# Altium schematic sheet Sheet1.SchDoc: FTDI-Based JTAG Board
size A4
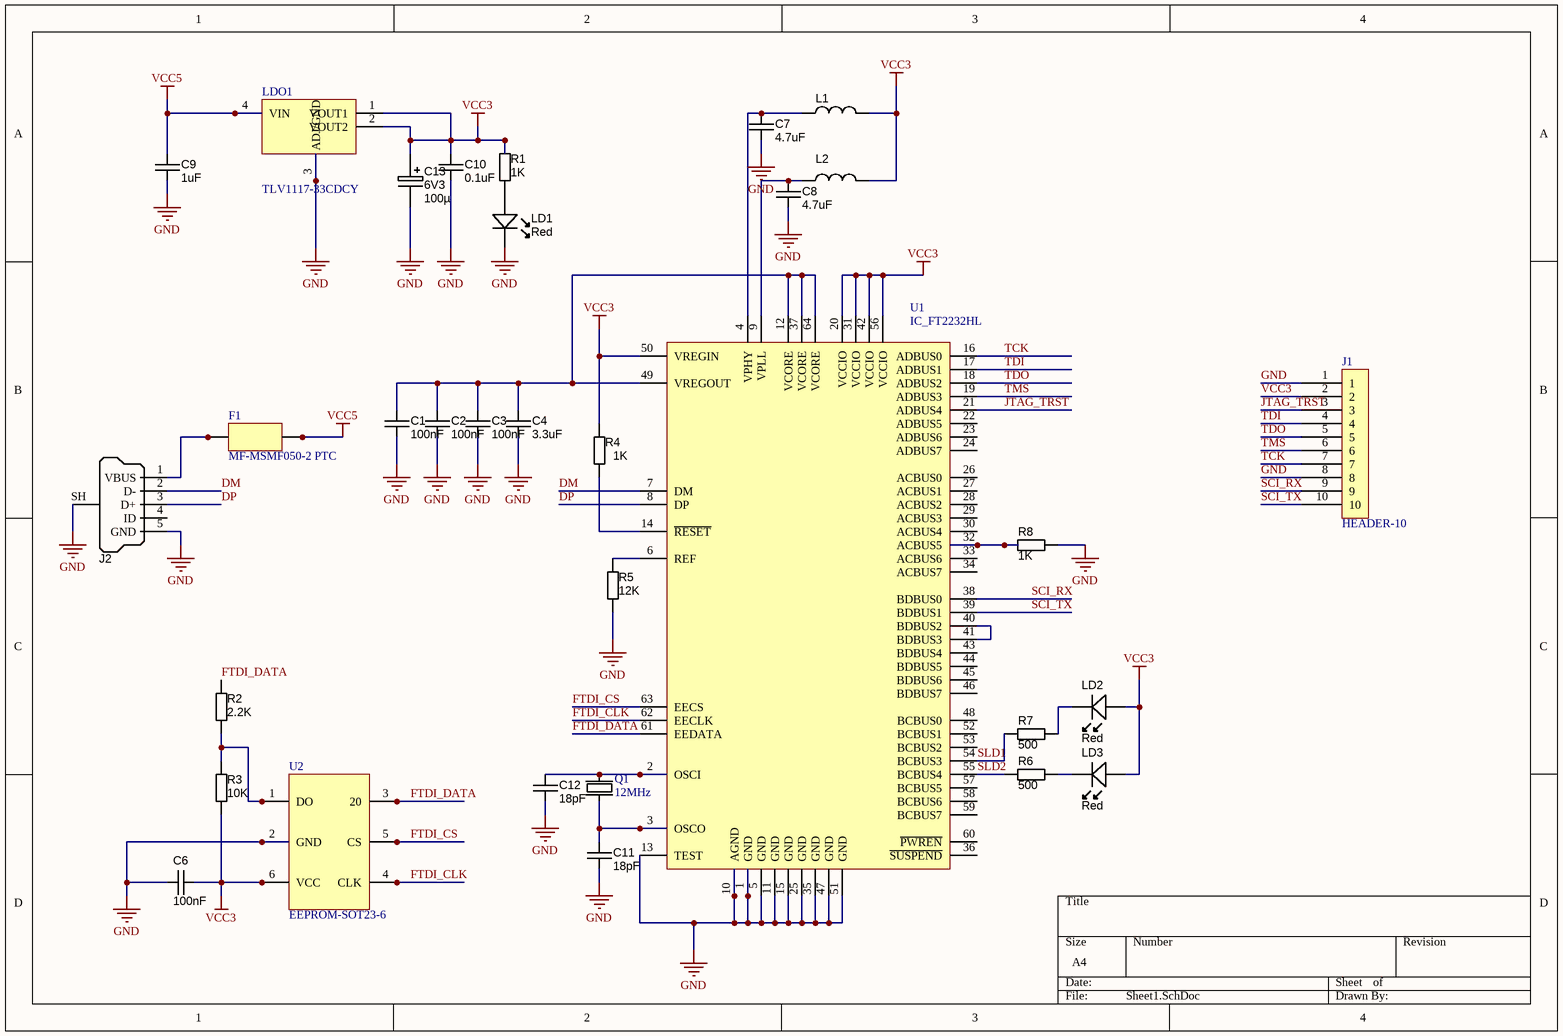
[diagram p0: Sheet1.SchDoc]

## Parts
C1  100nF  [CAPC1608X90N]
C2  100nF  [CAPC1608X90N]
C3  100nF  [CAPC1608X90N]
C4  3.3uF  [CAPC1608X90N]
C6  100nF  [CAPC1608X90N]
C7  4.7uF  [CAPC1608X90N]
C8  4.7uF  [CAPC1608X90N]
C9  1uF  [CAPC1608X90N]
C10  0.1uF  [CAPC1608X90N]
C11  18pF  [CAPC1608X90N]
C12  18pF  [CAPC1608X90N]
C13  Ratings: 6V3  [CAPMP3528X210N]  (hidden comment: 100µ)
F1  MF-MSMF050-2 PTC  [PTC-1218]
J1  HEADER-10  [MICRO-MATCH-10]
J2  USB Micro Type B (recommended if hand soldering)  [USB_Micro-B_FCI_SMD]  (value not drawn)
L1  120R @ 100 MHz  [INDC1608N]  (value not drawn)
L2  120R @ 100 MHz  [INDC1608N]  (value not drawn)
LD1  Red  [LED-0603-RED]
LD2  Red  [LED-0603-RED]
LD3  Red  [LED-0603-RED]
LDO1  TLV1117-33CDCY  [SOT223]
Q1  12MHz  [XTAL-5x3.2]
R1  value 1K  [RESC1608X55N]  (hidden comment: Thick Film)
R2  value 2.2K  [RESC1608X55N]  (hidden comment: Thick Film)
R3  value 10K  [RESC1608X55N]  (hidden comment: Thick Film)
R4  1K  [RESC1608X55N]
R5  value 12K  [RESC1608X55N]  (hidden comment: Thick Film)
R6  value 500  [RESC1608X55N]  (hidden comment: Thick Film)
R7  value 500  [RESC1608X55N]  (hidden comment: Thick Film)
R8  value 1K  [RESC1608X55N]  (hidden comment: Thick Film)
U1  IC_FT2232HL  [LQFP-64]
U2  EEPROM-SOT23-6  [SOT23-6-EEPROM]

## Nets
GND: C1.2 C2.2 C3.2 C4.2 C6.1 C7.2 C8.2 C9.2 C10.2 C11.2 C12.1 C13.2 J1.1 J1.8 J2.5(GND) J2.SH(Shell) LD1.K LDO1.3(ADJ/GND) R5.1 R8.1 U1.1(GND) U1.5(GND) U1.10(AGND) U1.11(GND) U1.13(TEST) U1.15(GND) U1.25(GND) U1.35(GND) U1.47(GND) U1.51(GND) U2.2(GND)
VCC3: C6.2 C10.1 C13.1 J1.2 L1.2 L2.2 LD2.A LD3.A LDO1.1(VOUT1) LDO1.2(VOUT2) R1.1 R3.2 R4.2 U1.20(VCCIO) U1.31(VCCIO) U1.42(VCCIO) U1.50(VREGIN) U1.56(VCCIO) U2.6(VCC)
VCC5: C9.1 F1.22 LDO1.4(VIN)
DM: J2.2(D-) U1.7(DM)
DP: J2.3(D+) U1.8(DP)
FTDI_CLK: U1.62(EECLK) U2.4(CLK)
FTDI_CS: U1.63(EECS) U2.5(CS)
FTDI_DATA: R2.1 U1.61(EEDATA) U2.3(20)
JTAG_TRST: J1.3 U1.21(ADBUS4)
SCI_RX: J1.9 U1.38(BDBUS0)
SCI_TX: J1.10 U1.39(BDBUS1)
SLD1: R7.2 U1.54(BCBUS3)
SLD2: R6.2 U1.55(BCBUS4)
TCK: J1.7 U1.16(ADBUS0)
TDI: J1.4 U1.17(ADBUS1)
TDO: J1.5 U1.18(ADBUS2)
TMS: J1.6 U1.19(ADBUS3)
NetC1_1: C1.1 C2.1 C3.1 C4.1 U1.12(VCORE) U1.37(VCORE) U1.49(VREGOUT) U1.64(VCORE)
NetC7_1: C7.1 L1.1 U1.4(VPHY)
NetC8_1: C8.1 L2.1 U1.9(VPLL)
NetC11_1: C11.1 Q1.1 U1.3(OSCO)
NetC12_2: C12.2 Q1.2 U1.2(OSCI)
NetF1_21: F1.21 J2.1(VBUS)
NetLD1_A: LD1.A R1.2
NetLD2_K: LD2.K R7.1
NetLD3_K: LD3.K R6.1
NetR2_2: R2.2 R3.1 U2.1(DO)
NetR4_1: R4.1 U1.14(~{RESET})
NetR5_2: R5.2 U1.6(REF)
NetR8_2: R8.2 U1.32(ACBUS5)
NetU1_40: U1.40(BDBUS2) U1.41(BDBUS3)

Not connected (* = marked no-connect by the designer): J2 4(ID); U1 22(ADBUS5) 23(ADBUS6) 24(ADBUS7) 26(ACBUS0) 27(ACBUS1) 28(ACBUS2) 29(ACBUS3) 30(ACBUS4) 33(ACBUS6) 34(ACBUS7) 36(~{SUSPEND}) 43(BDBUS4) 44(BDBUS5) 45(BDBUS6) 46(BDBUS7) 48(BCBUS0) 52(BCBUS1) 53(BCBUS2) 57(BCBUS5) 58(BCBUS6) 59(BCBUS7) 60(~{PWREN})

## Library data of the parts
C1-C4 C6-C12 = CAPC_39p_0603_NP0_100V_1%: Capacitor SMD Cer 39pF 1% 100V NP0 0603; Manufacturer 1: AVX Corporation; Manufacturer Part Number 1: 06031A390FAT2A; Ratings: 100V; NP0; SCDType: source; Temperature Coefficient: C0G, NP0; Tolerance: ±1%; Operating Temperature: -55°C ~ 125°C; Package / Case: 0603 (1608 Metric); Supplier 1: Digi-Key; Supplier Part Number 1: 478-5773-6-ND; RoHS 1: RoHS Compliant; ComponentLink1URL: http://www.avx.com/docs/Catalogs/ccog.pdf; ComponentLink1Description: http://www.avx.com/docs/Catalogs/ccog.pdf; Supplier 2: Digi-Key; Supplier Part Number 2: C0603C390F1GACTU-ND; Manufacturer 2: Kemet; Manufacturer Part Number 2: C0603C390F1GACTU; RoHS 2: RoHS Compliant; ComponentLink2URL: http://www.kemet.com/datasheets&C0603C390F1GACTU; ComponentLink2Description: http://www.kemet.com/datasheets&C0603C390F1GACTU; Supplier 3: Mouser; Supplier Part Number 3: 81-GRM1885C2A390FA1J; Manufacturer 3: Murata; Manufacturer Part Number 3: GRM1885C2A390FA01J; RoHS 3: RoHS Compliant; ComponentLink3URL: http://psearch.murata.com/capacitor/product/GRM0225C1C1R0WD05%23.pdf; ComponentLink3Description: http://psearch.murata.com/capacitor/product/GRM0225C1C1R0WD05%23.pdf
  C1-C3 C6: Value: 100nF
  C4: Value: 3.3uF
  C7 C8: Value: 4.7uF
  C9: Value: 1uF
  C10: Value: 0.1uF
  C11 C12: Value: 18pF
C13 = CAPT_100u_1210_6V3: Capacitor SMD Tantalum 100uF 20% 6.3V 1210; Manufacturer 1: AVX Corporation; Manufacturer Part Number 1: TCJB107M006R0045; SCDType: spec; Package / Case: 1210 (3528 Metric); Tolerance: ±20%; Material: Tantalum; Supplier 1: Digi-Key; Supplier Part Number 1: 478-4711-1-ND; Value: 100µ
F1 = MF-MSMF050-2 PTC: pin to pad: 21>1 22>2
J2 = USB_Micro_TypeB_FCI: Connector SMD-THD USB Micro Type B middle mount; Manufacturer 1: FCI; Manufacturer Part Number 1: 10103593-0001LF; SCDType: undef; Package / Case: SMD/THD mid-mount; Supplier 1: Digi-Key; Supplier Part Number 1: 609-4049-1-ND
L1 = FERRITE_120R-100MHz_0603: Ferrite bead 120 Ohm at 100 MHz 2A 0603 SMD; Manufacturer 1: Murata Electronics North America; Manufacturer Part Number 1: 600Ohm@100MHZ; Current: 900mA; DC Resistance (DCR): 172.9 mOhm Max; Frequency - Self Resonant: 23MHz; Frequency - Test: 100kHz; Impedance @ Frequency: 120 Ohm @ 100MHz; Filter Type: Differential Mode - Single; Number of Lines: 1; Ratings: 2 A; 50 mO DC; SCDType: source; Current - Saturation: 900mA; Current - Temperature Rise: 900mA; Applications: Power Supplies; Package / Case: 1210 (3225 Metric); Operating Temperature: -40°C ~ 105°C; ComponentLink1URL: http://www.yuden.co.jp/ut/product/pdf/wound02_e.pdf; ComponentLink1Description: http://www.yuden.co.jp/ut/product/pdf/wound02_e.pdf; Supplier 1: Digi-Key; Supplier Part Number 1: 490-1037-1-ND; Current Rating: 2A; Mounting Type: Surface Mount; Height (Max): 0.037" (0.95mm); Size / Dimension: 0.063" L x 0.031" W (1.60mm x 0.80mm); ComponentLink2URL: http://search.murata.co.jp/Ceramy/image/img/PDF/ENG/L0110S0100BLM18P.pdf; ComponentLink2Description: http://search.murata.co.jp/Ceramy/image/img/PDF/ENG/L0110S0100BLM18P.pdf; Value: 120R @ 100 MHz
L2 = FERRITE_120R-100MHz_0603: Ferrite bead 120 Ohm at 100 MHz 2A 0603 SMD; Manufacturer 1: Murata Electronics North America; Manufacturer Part Number 1: BLM18PG121SN1D; Current: 900mA; DC Resistance (DCR): 172.9 mOhm Max; Frequency - Self Resonant: 23MHz; Frequency - Test: 100kHz; Impedance @ Frequency: 120 Ohm @ 100MHz; Filter Type: Differential Mode - Single; Number of Lines: 1; Ratings: 2 A; 50 mO DC; SCDType: source; Current - Saturation: 900mA; Current - Temperature Rise: 900mA; Applications: Power Supplies; Package / Case: 1210 (3225 Metric); Operating Temperature: -40°C ~ 105°C; ComponentLink1URL: http://www.yuden.co.jp/ut/product/pdf/wound02_e.pdf; ComponentLink1Description: http://www.yuden.co.jp/ut/product/pdf/wound02_e.pdf; Supplier 1: Digi-Key; Supplier Part Number 1: 490-1037-1-ND; Current Rating: 2A; Mounting Type: Surface Mount; Height (Max): 0.037" (0.95mm); Size / Dimension: 0.063" L x 0.031" W (1.60mm x 0.80mm); ComponentLink2URL: http://search.murata.co.jp/Ceramy/image/img/PDF/ENG/L0110S0100BLM18P.pdf; ComponentLink2Description: http://search.murata.co.jp/Ceramy/image/img/PDF/ENG/L0110S0100BLM18P.pdf; Value: 120R @ 100 MHz
LD1-LD3 = LED_SMD_Red_0603_220mcd: LED 0603 SMD Hyper Red 630nm 220mcd 20mA; Manufacturer 1: Kingbright Company LLC; Manufacturer Part Number 1: APT1608SURCK; Material: AlGaInP on GaAs; Ratings: 220 mcd; 630 nm; Voltage - Forward (Vf) Typ: 1.95V; Voltage - Forward (Vf) @ 10mA: 1.9V; SCDType: source; Package / Case: 0603 (1608 metric); Supplier 1: Digi-Key; Supplier Part Number 1: 754-1123-1-ND; ComponentLink1URL: http://www.us.kingbright.com/images/catalog/SPEC/APT1608SURCK.pdf; ComponentLink1Description: http://www.us.kingbright.com/images/catalog/SPEC/APT1608SURCK.pdf
LDO1 = TLV1117-33CDCY: pin to pad: 1>4 3>1 4>3
Q1 = XTAL_5x3.2
R1-R8 = RES_1K_0603_5%: Resistor SMD chip 1k Ohm 0.1W 5% 0603; Manufacturer 1: Yageo; Manufacturer Part Number 1: RC0603JR-071KL; Ratings: 1/10 W; SCDType: spec; Package / Case: 0603 (1608 metric); Tolerance: ±5%; Material: Thick Film; Supplier 1: Digi-Key; Supplier Part Number 1: 311-1.0KGRCT-ND; Supplier 2: Digi-Key; Supplier Part Number 2: 541-1.0KGCT-ND; Manufacturer 2: Vishay Dale; Manufacturer Part Number 2: CRCW06031K00JNEA; ComponentLink2URL: http://www.vishay.com/doc?20008; ComponentLink2Description: http://www.vishay.com/doc?20008; ComponentLink1URL: http://www.yageo.com/documents/recent/PYu-RC0603_51_RoHS_L_4.pdf; ComponentLink1Description: http://www.yageo.com/documents/recent/PYu-RC0603_51_RoHS_L_4.pdf
  R4: Value: 1K
U1 = IC_FT2232HL: Dual High Speed USB to Multipurpose UART/FIFO; Manufacturer: *; Note: *; ManufacturerPartNo: *